# Altium schematic sheet CarrierConnector.SchDoc
size A4; CompanyName: Technische Hochschule Nürnberg Georg Simon Ohm; Organization: UltraZohm; Address1: Kesslerplatz 12; Address2: 90489 Nürnberg; Address3: GERMANY; DocumentNumber: 2; SheetNumber: 1; SheetTotal: 2; Website: www.ultrazohm.com
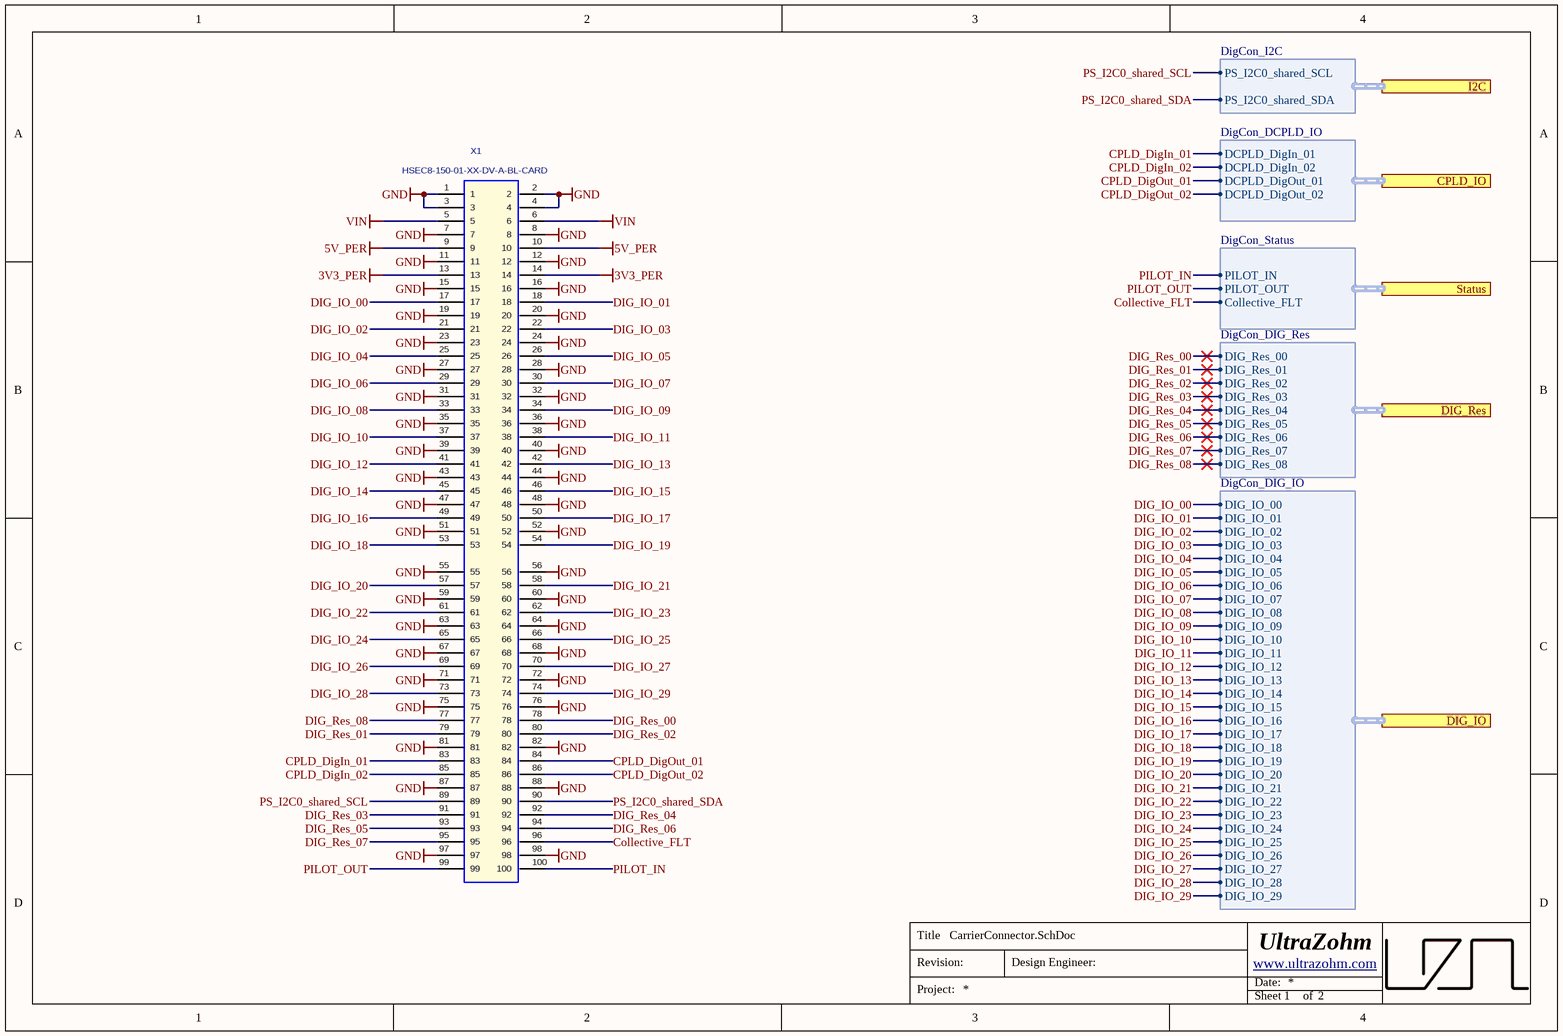
[diagram p0: CarrierConnector.SchDoc]

## Parts
X1  HSEC8-150-01-XX-DV-A-BL-CARD  [HSEC8-150-01-XX-DV-A-BL-CARD]  (no BOM)

## Ports
CPLD_IO (harness DigCon_DCPLD_IO, see TopSheet[2B], DigitalConnector[4A]), DIG_IO (harness DigCon_DIG_IO, see TopSheet[2A], DigitalConnector[4C]), DIG_Res (harness DigCon_DIG_Res, see TopSheet[2B]), I2C (harness DigCon_I2C, see TopSheet[2B], DigitalConnector[4A]), Status (harness DigCon_Status, see TopSheet[2B], DigitalConnector[4B])

## Harnesses
DigCon_I2C: PS_I2C0_shared_SDA, PS_I2C0_shared_SCL
DigCon_Status: PILOT_IN, PILOT_OUT, Collective_FLT
DigCon_DCPLD_IO: DCPLD_DigIn_01, DCPLD_DigIn_02, DCPLD_DigOut_01, DCPLD_DigOut_02
DigCon_DIG_IO: DIG_IO_01, DIG_IO_02, DIG_IO_03, DIG_IO_04, DIG_IO_05, DIG_IO_06, DIG_IO_07, DIG_IO_08, DIG_IO_09, DIG_IO_10, DIG_IO_11, DIG_IO_12, DIG_IO_13, DIG_IO_14, DIG_IO_15, DIG_IO_16, DIG_IO_17, DIG_IO_18, DIG_IO_19, DIG_IO_20, DIG_IO_21, DIG_IO_22, DIG_IO_23, DIG_IO_24, DIG_IO_25, DIG_IO_26, DIG_IO_27, DIG_IO_28, DIG_IO_29, DIG_IO_00
DigCon_DIG_Res: DIG_Res_01, DIG_Res_02, DIG_Res_03, DIG_Res_04, DIG_Res_05, DIG_Res_06, DIG_Res_07, DIG_Res_00, DIG_Res_08

## Nets
3V3_PER: X1.13 X1.14
5V_PER: X1.9 X1.10
GND: X1.1 X1.2 X1.3 X1.4 X1.7 X1.8 X1.11 X1.12 X1.15 X1.16 X1.19 X1.20 X1.23 X1.24 X1.27 X1.28 X1.31 X1.32 X1.35 X1.36 X1.39 X1.40 X1.43 X1.44 X1.47 X1.48 X1.51 X1.52 X1.55 X1.56 X1.59 X1.60 X1.63 X1.64 X1.67 X1.68 X1.71 X1.72 X1.75 X1.76 X1.81 X1.82 X1.87 X1.88 X1.97 X1.98
VIN: X1.5 X1.6
Collective_FLT: X1.96 ; port Status.Collective_FLT
CPLD_DigIn_01: X1.83 ; port CPLD_IO.DCPLD_DigIn_01
CPLD_DigIn_02: X1.85 ; port CPLD_IO.DCPLD_DigIn_02
CPLD_DigOut_01: X1.84 ; port CPLD_IO.DCPLD_DigOut_01
CPLD_DigOut_02: X1.86 ; port CPLD_IO.DCPLD_DigOut_02
DIG_IO_00: X1.17 ; port DIG_IO.DIG_IO_00
DIG_IO_01: X1.18 ; port DIG_IO.DIG_IO_01
DIG_IO_02: X1.21 ; port DIG_IO.DIG_IO_02
DIG_IO_03: X1.22 ; port DIG_IO.DIG_IO_03
DIG_IO_04: X1.25 ; port DIG_IO.DIG_IO_04
DIG_IO_05: X1.26 ; port DIG_IO.DIG_IO_05
DIG_IO_06: X1.29 ; port DIG_IO.DIG_IO_06
DIG_IO_07: X1.30 ; port DIG_IO.DIG_IO_07
DIG_IO_08: X1.33 ; port DIG_IO.DIG_IO_08
DIG_IO_09: X1.34 ; port DIG_IO.DIG_IO_09
DIG_IO_10: X1.37 ; port DIG_IO.DIG_IO_10
DIG_IO_11: X1.38 ; port DIG_IO.DIG_IO_11
DIG_IO_12: X1.41 ; port DIG_IO.DIG_IO_12
DIG_IO_13: X1.42 ; port DIG_IO.DIG_IO_13
DIG_IO_14: X1.45 ; port DIG_IO.DIG_IO_14
DIG_IO_15: X1.46 ; port DIG_IO.DIG_IO_15
DIG_IO_16: X1.49 ; port DIG_IO.DIG_IO_16
DIG_IO_17: X1.50 ; port DIG_IO.DIG_IO_17
DIG_IO_18: X1.53 ; port DIG_IO.DIG_IO_18
DIG_IO_19: X1.54 ; port DIG_IO.DIG_IO_19
DIG_IO_20: X1.57 ; port DIG_IO.DIG_IO_20
DIG_IO_21: X1.58 ; port DIG_IO.DIG_IO_21
DIG_IO_22: X1.61 ; port DIG_IO.DIG_IO_22
DIG_IO_23: X1.62 ; port DIG_IO.DIG_IO_23
DIG_IO_24: X1.65 ; port DIG_IO.DIG_IO_24
DIG_IO_25: X1.66 ; port DIG_IO.DIG_IO_25
DIG_IO_26: X1.69 ; port DIG_IO.DIG_IO_26
DIG_IO_27: X1.70 ; port DIG_IO.DIG_IO_27
DIG_IO_28: X1.73 ; port DIG_IO.DIG_IO_28
DIG_IO_29: X1.74 ; port DIG_IO.DIG_IO_29
DIG_Res_00: X1.78 ; port DIG_Res.DIG_Res_00
DIG_Res_01: X1.79 ; port DIG_Res.DIG_Res_01
DIG_Res_02: X1.80 ; port DIG_Res.DIG_Res_02
DIG_Res_03: X1.91 ; port DIG_Res.DIG_Res_03
DIG_Res_04: X1.92 ; port DIG_Res.DIG_Res_04
DIG_Res_05: X1.93 ; port DIG_Res.DIG_Res_05
DIG_Res_06: X1.94 ; port DIG_Res.DIG_Res_06
DIG_Res_07: X1.95 ; port DIG_Res.DIG_Res_07
DIG_Res_08: X1.77 ; port DIG_Res.DIG_Res_08
PILOT_IN: X1.100 ; port Status.PILOT_IN
PILOT_OUT: X1.99 ; port Status.PILOT_OUT
PS_I2C0_shared_SCL: X1.89 ; port I2C.PS_I2C0_shared_SCL
PS_I2C0_shared_SDA: X1.90 ; port I2C.PS_I2C0_shared_SDA

## Notes on the sheet
- Title
- Revision:
- Design Engineer:
- Date:
- Project:
- Sheet
- of

## Library data of the parts
X1 = HSEC8-150-01-XX-DV-A-BL-CARD: Mating Card Layout for HSEC8-150-01-XX-DV-A-BL; Manufacturer: SAMTEC; Created from: T. Wendt; Number of positions: 100; Created: 2018_04_23_AGeiger; Category: SAMTEC; Manufacturer Part Number: HSEC8-150-01-XX-DV-A-BL-CARD; PartID: 2; Created On: 26.02.2021 16:36:12; ComponentLink1Description: Homepage; ComponentLink1URL: https://www.samtec.com/products/hsec8-dp; Component Type: Board to Board Connector; Device Package: PCB Shape; Last Updated: 26.02.2021 16:37:20; Mounting Type: PCB Shape; Series: HSEC8; Supplier 1: SAMTEC; Supplier Part Number 1: NA; Type: Board to Board Connector; Live Cycle Status: 1; Stock number: not stored; Number of rows: 2